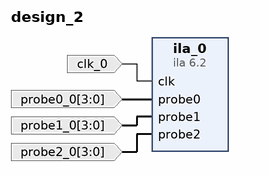
[diagram p0: block diagram of the top level]
# Vivado block design design_2, xc7a35ticsg324-1L, Vivado 2025.2
create_bd_design design_2

create_bd_port -dir I -type clk clk_0
create_bd_port -dir I -from 3 -to 0 probe0_0
create_bd_port -dir I -from 3 -to 0 probe1_0
create_bd_port -dir I -from 3 -to 0 probe2_0

create_bd_cell -type ip -vlnv xilinx.com:ip:ila:6.2 ila_0
set_property -dict [list \
  CONFIG.C_MONITOR_TYPE Native \
  CONFIG.C_NUM_OF_PROBES 3 \
  CONFIG.C_PROBE0_WIDTH 4 \
  CONFIG.C_PROBE1_WIDTH 4 \
  CONFIG.C_PROBE2_WIDTH 4 \
] [get_bd_cells ila_0]

# ---- connections ----

connect_bd_net -net clk_0_1 [get_bd_ports clk_0] [get_bd_pins ila_0/clk]
connect_bd_net -net probe0_0_1 [get_bd_ports probe0_0] [get_bd_pins ila_0/probe0]
connect_bd_net -net probe1_0_1 [get_bd_ports probe1_0] [get_bd_pins ila_0/probe1]
connect_bd_net -net probe2_0_1 [get_bd_ports probe2_0] [get_bd_pins ila_0/probe2]

validate_bd_design
save_bd_design
